# Altium schematic sheet controls.SchDoc
size A4
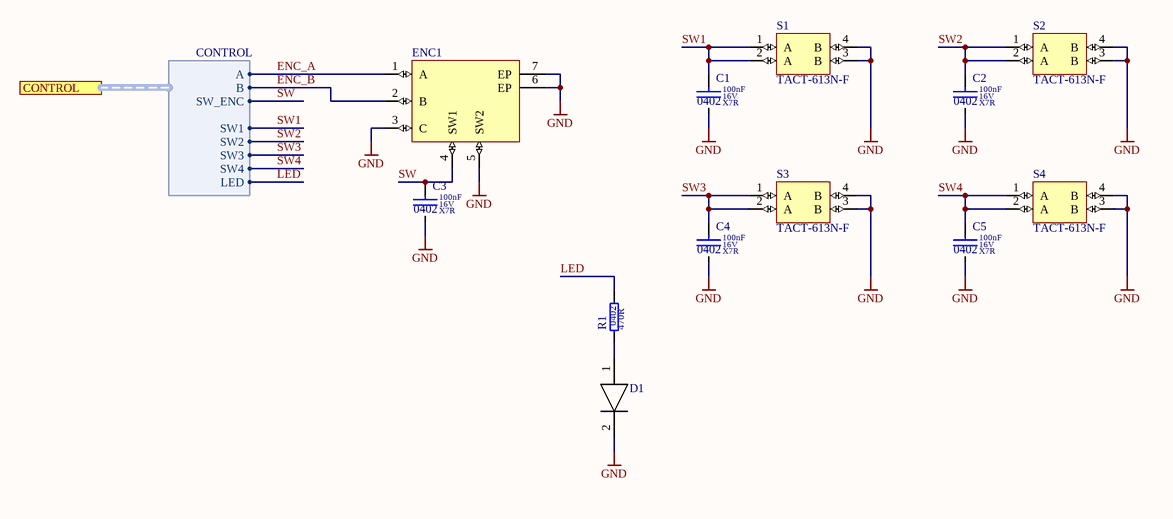
[diagram p0: controls.SchDoc]

## Parts
C1  value 100nF  Dielectric: X7R  Voltage: 16V  SCH_Footprint: 0402  [C_0402_1005]  (hidden comment: Ceramic X7R)
C2  value 100nF  Dielectric: X7R  Voltage: 16V  SCH_Footprint: 0402  [C_0402_1005]  (hidden comment: Ceramic X7R)
C3  value 100nF  Dielectric: X7R  Voltage: 16V  SCH_Footprint: 0402  [C_0402_1005]  (hidden comment: Ceramic X7R)
C4  value 100nF  Dielectric: X7R  Voltage: 16V  SCH_Footprint: 0402  [C_0402_1005]  (hidden comment: Ceramic X7R)
C5  value 100nF  Dielectric: X7R  Voltage: 16V  SCH_Footprint: 0402  [C_0402_1005]  (hidden comment: Ceramic X7R)
D1  LED_5mm  [LED_5mm]  (value not drawn)
ENC1  Wurth Elektronik 482016514001  [ENCODER]  (value not drawn)
R1  value 470R  SCH_Footprint: 0402  [R_0402_1005]  (hidden comment: Resistor)
S1  TACT-613N-F  [TACT-613N-F]
S2  TACT-613N-F  [TACT-613N-F]
S3  TACT-613N-F  [TACT-613N-F]
S4  TACT-613N-F  [TACT-613N-F]

## Ports
CONTROL (harness CONTROL)

## Harnesses
CONTROL: A, B, SW_ENC, SW1, SW2, SW3, SW4, LED

## Nets
GND: C1.2 C2.2 C3.2 C4.2 C5.2 D1.2(Cathode) ENC1.3(C) ENC1.5(SW2) ENC1.6(EP) ENC1.7(EP) S1.3(B) S1.4(B) S2.3(B) S2.4(B) S3.3(B) S3.4(B) S4.3(B) S4.4(B)
ENC_A: ENC1.1(A) ; port CONTROL.A
ENC_B: ENC1.2(B) ; port CONTROL.B
LED: R1.2 ; port CONTROL.LED
SW: C3.1 ENC1.4(SW1) ; port CONTROL.SW_ENC
SW1: C1.1 S1.1(A) S1.2(A) ; port CONTROL.SW1
SW2: C2.1 S2.1(A) S2.2(A) ; port CONTROL.SW2
SW3: C4.1 S3.1(A) S3.2(A) ; port CONTROL.SW3
SW4: C5.1 S4.1(A) S4.2(A) ; port CONTROL.SW4
NetD1_1: D1.1(Anode) R1.1

## Library data of the parts
C1-C5 = C_100nF_16V_X7R_0402_10: Capacitor; Manufacturer: Murata; Manufacturer Part Number: GRM155R71C104KA88D; Tolerance (%): 10; Part Number: C_100nF_16V_X7R_0402_10; HelpURL: https://www.mouser.com/ds/2/281/c02e-2905.pdf; Supplier 1: TME; Supplier 2: RS Components; Supplier 3: Farnell; Supplier 4: Mouser; Supplier Part Number 4: 81-GRM155R71C104KA88; Supplier 5: Digi-Key
D1 = LED_5mm: LED_5mm Diameter
ENC1 = ENCODER
R1 = R_470R_0402_1: Manufacturer: Yageo; Manufacturer Part Number: RC0402FR-07470RL; Voltage: 50V; Power: 63mW; Tolerance: 1%; Part Number: R_470R_0402_1; HelpURL: http://datasheet.octopart.com/RC0402FR-07470RL-Yageo-datasheet-10408619.pdf; Supplier 1: TME; Supplier Part Number 1: RC0402FR-07470R; Supplier 2: RS Components; Supplier 3: Farnell; Supplier Part Number 3: 9239197; Supplier 4: Mouser; Supplier Part Number 4: 603-RC0402FR-07470RL; Supplier 5: Digi-Key; Supplier Part Number 5: 311-470LRCT-ND